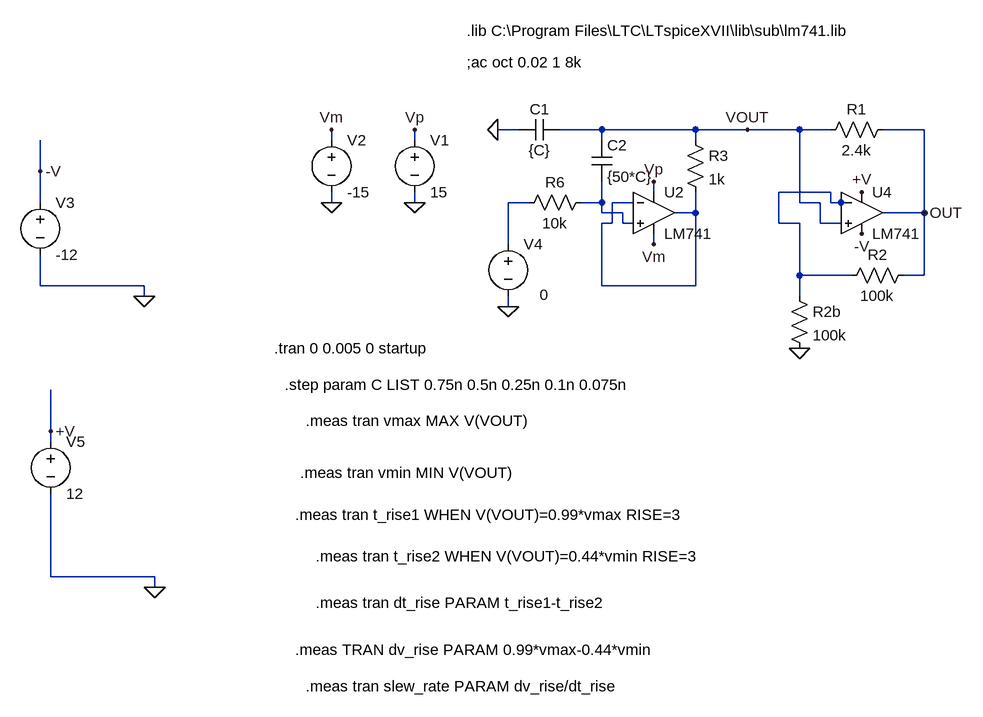
[diagram p0: schematic FHN_basic_circuito_acelerado_lm741.asc]
FHN_basic_circuito_acelerado_lm741.asc, the LTspice schematic file:
Version 4
SHEET 1 1236 712
WIRE -16 -160 -48 -160
WIRE 112 -160 48 -160
WIRE 256 -160 112 -160
WIRE 336 -160 256 -160
WIRE 416 -160 336 -160
WIRE 464 -160 416 -160
WIRE 608 -160 544 -160
WIRE -304 -144 -304 -160
WIRE -176 -144 -176 -160
WIRE 112 -144 112 -160
WIRE 256 -144 256 -160
WIRE -752 -96 -752 -144
WIRE 192 -64 192 -80
WIRE 464 -64 384 -64
WIRE -752 -48 -752 -96
WIRE -304 -48 -304 -64
WIRE -176 -48 -176 -64
WIRE 0 -48 -32 -48
WIRE 112 -48 112 -80
WIRE 112 -48 80 -48
WIRE 160 -48 128 -48
WIRE 416 -48 416 -160
WIRE 448 -48 416 -48
WIRE 464 -48 464 -64
WIRE 480 -48 464 -48
WIRE 496 -48 480 -48
WIRE 112 -32 112 -48
WIRE 144 -32 112 -32
WIRE 256 -32 256 -64
WIRE 256 -32 224 -32
WIRE 608 -32 608 -160
WIRE 608 -32 544 -32
WIRE 128 -16 128 -48
WIRE 128 -16 112 -16
WIRE 144 -16 144 -32
WIRE 160 -16 144 -16
WIRE 384 -16 384 -64
WIRE 416 -16 384 -16
WIRE 448 -16 448 -48
WIRE 480 -16 448 -16
WIRE -32 16 -32 -48
WIRE 192 16 192 0
WIRE 416 64 416 -16
WIRE 496 64 416 64
WIRE 608 64 608 -32
WIRE 608 64 576 64
WIRE -752 80 -752 32
WIRE -592 80 -752 80
WIRE 112 80 112 -16
WIRE 256 80 256 -32
WIRE 256 80 112 80
WIRE -592 96 -592 80
WIRE 416 96 416 64
WIRE -32 112 -32 96
WIRE -736 304 -736 240
WIRE -736 320 -736 304
WIRE -736 528 -736 400
WIRE -576 528 -736 528
WIRE -576 544 -576 528
FLAG -176 -48 0
FLAG -304 -48 0
FLAG -752 -96 -V
FLAG -32 112 0
FLAG -48 -160 0
FLAG 416 176 0
FLAG -176 -160 Vp
FLAG -304 -160 Vm
FLAG 192 -80 Vp
FLAG 192 16 Vm
FLAG -576 544 0
FLAG -592 96 0
FLAG -736 304 +V
FLAG 512 -64 +V
FLAG 512 0 -V
FLAG 608 -32 OUT
FLAG 336 -160 VOUT
SYMBOL voltage -176 -160 R0
WINDOW 123 0 0 Left 0
WINDOW 39 0 0 Left 0
SYMATTR InstName V1
SYMATTR Value 15
SYMBOL voltage -304 -160 R0
SYMATTR InstName V2
SYMATTR Value -15
SYMBOL voltage -32 0 R0
WINDOW 3 48 94 Left 2
WINDOW 123 24 124 Left 2
WINDOW 39 0 0 Left 0
SYMATTR Value 0
SYMATTR InstName V4
SYMBOL res 240 -160 R0
SYMATTR InstName R3
SYMATTR Value 1k
SYMBOL cap 96 -144 R0
SYMATTR InstName C2
SYMATTR Value {50*C}
SYMBOL cap 48 -176 R90
WINDOW 0 0 32 VBottom 2
WINDOW 3 32 32 VTop 2
SYMATTR InstName C1
SYMATTR Value {C}
SYMBOL res 560 -176 R90
WINDOW 0 0 56 VBottom 2
WINDOW 3 32 56 VTop 2
SYMATTR InstName R1
SYMATTR Value 2.4k
SYMBOL res 592 48 R90
WINDOW 0 0 56 VBottom 2
WINDOW 3 32 56 VTop 2
SYMATTR InstName R2
SYMATTR Value 100k
SYMBOL res 400 80 R0
SYMATTR InstName R2b
SYMATTR Value 100k
SYMBOL voltage -752 -64 R0
SYMATTR InstName V3
SYMATTR Value -12
SYMBOL voltage -736 304 R0
SYMATTR InstName V5
SYMATTR Value 12
SYMBOL res 96 -64 R90
WINDOW 0 0 56 VBottom 2
WINDOW 3 32 56 VTop 2
SYMATTR InstName R6
SYMATTR Value 10k
SYMBOL OpAmps\\opamp2 192 -96 R0
SYMATTR InstName U2
SYMATTR Value LM741
SYMBOL OpAmps\\opamp2 512 -96 R0
SYMATTR InstName U4
SYMATTR Value LM741
TEXT -392 176 Left 2 !.tran 0 0.005 0 startup
TEXT -96 -264 Left 2 !;ac oct 0.02 1 8k
TEXT -96 -312 Left 2 !.lib C:\\Program Files\\LTC\\LTspiceXVII\\lib\\sub\\lm741.lib
TEXT -376 232 Left 2 !.step param C LIST 0.75n 0.5n 0.25n 0.1n 0.075n
TEXT -344 288 Left 2 !.meas tran vmax MAX V(VOUT)
TEXT -352 368 Left 2 !.meas tran vmin MIN V(VOUT)
TEXT -360 432 Left 2 !.meas tran t_rise1 WHEN V(VOUT)=0.99*vmax RISE=3
TEXT -328 496 Left 2 !.meas tran t_rise2 WHEN V(VOUT)=0.44*vmin RISE=3
TEXT -328 568 Left 2 !.meas tran dt_rise PARAM t_rise1-t_rise2
TEXT -360 640 Left 2 !.meas TRAN dv_rise PARAM 0.99*vmax-0.44*vmin
TEXT -344 696 Left 2 !.meas tran slew_rate PARAM dv_rise/dt_rise

The netlist it stands for:
* FHN_basic_circuito_acelerado_lm741.asc
V1 Vp 0 15
V2 Vm 0 -15
V4 N002 0 0
R3 VOUT N004 1k
C2 VOUT N003 {50*C}
C1 VOUT 0 {C}
R1 OUT VOUT 2.4k
R2 OUT N001 100k
R2b N001 0 100k
V3 -V 0 -12
V5 +V 0 12
R6 N003 N002 10k
XU2 N003 N004 Vp Vm N004 LM741  ; pins In+ In- V+ V- OUT
XU4 VOUT N001 +V -V OUT LM741  ; pins In+ In- V+ V- OUT
.tran 0 0.005 0 startup
;ac oct 0.02 1 8k
.lib C:\Program Files\LTC\LTspiceXVII\lib\sub\lm741.lib
.step param C LIST 0.75n 0.5n 0.25n 0.1n 0.075n
.meas tran vmax MAX V(VOUT)
.meas tran vmin MIN V(VOUT)
.meas tran t_rise1 WHEN V(VOUT)=0.99*vmax RISE=3
.meas tran t_rise2 WHEN V(VOUT)=0.44*vmin RISE=3
.meas tran dt_rise PARAM t_rise1-t_rise2
.meas TRAN dv_rise PARAM 0.99*vmax-0.44*vmin
.meas tran slew_rate PARAM dv_rise/dt_rise
.backanno
.end